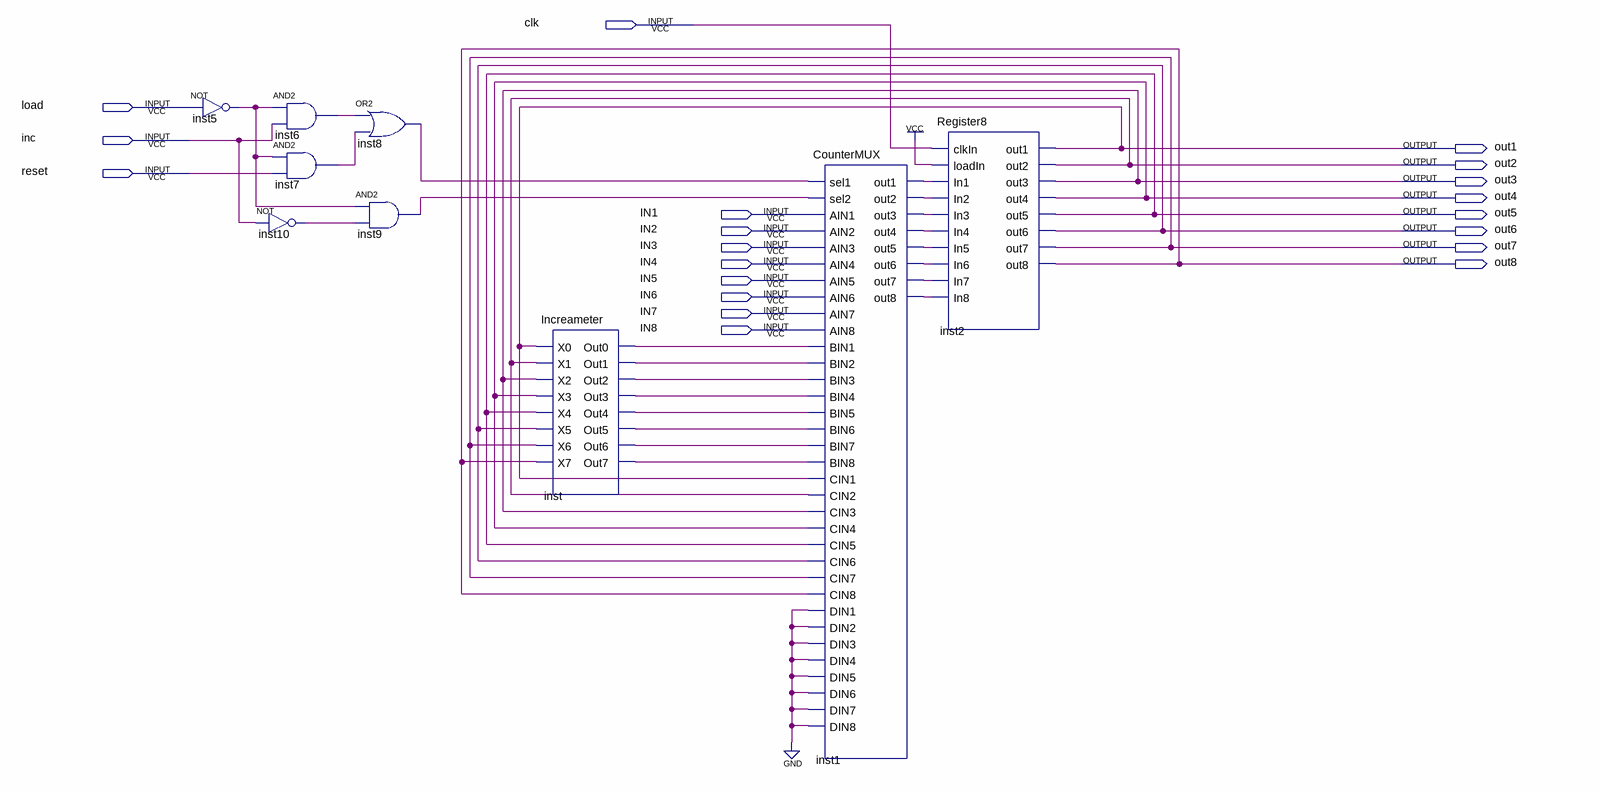
[diagram p0: schematic sheet]
// Quartus schematic ProgramCounter.bdf as structural Verilog: 9 symbols, 20 pins
module ProgramCounter (
  input  clk,
  input  load,
  input  inc,
  input  reset,
  input  IN1,
  input  IN2,
  input  IN3,
  input  IN4,
  input  IN5,
  input  IN6,
  input  IN7,
  input  IN8,
  output out1,
  output out2,
  output out3,
  output out4,
  output out5,
  output out6,
  output out7,
  output out8
);

  wire inst1_out1, inst1_out2, inst1_out3, inst1_out4, inst1_out5, inst1_out6, inst1_out7, inst1_out8,
       inst5_out, inst6_out, inst7_out, inst8_out, inst9_out, inst10_out, inst_out0, inst_out1, inst_out2,
       inst_out3, inst_out4, inst_out5, inst_out6, inst_out7;

  not inst5 (inst5_out, load);
  and inst6 (inst6_out, inst5_out, inc);
  and inst7 (inst7_out, inst5_out, reset);
  not inst10 (inst10_out, inc);
  or inst8 (inst8_out, inst6_out, inst7_out);
  and inst9 (inst9_out, inst5_out, inst10_out);
  Increameter inst (
    .X0(out1), .X1(out2), .X2(out3), .X3(out4), .X4(out5), .X5(out6), .X6(out7), .X7(out8), .Out0(inst_out0),
    .Out1(inst_out1), .Out2(inst_out2), .Out3(inst_out3), .Out4(inst_out4), .Out5(inst_out5),
    .Out6(inst_out6), .Out7(inst_out7));
  CounterMUX inst1 (
    .sel1(inst8_out), .sel2(inst9_out), .AIN1(IN1), .AIN2(IN2), .AIN3(IN3), .AIN4(IN4), .AIN5(IN5),
    .AIN6(IN6), .AIN7(IN7), .AIN8(IN8), .BIN1(inst_out0), .BIN2(inst_out1), .BIN3(inst_out2),
    .BIN4(inst_out3), .BIN5(inst_out4), .BIN6(inst_out5), .BIN7(inst_out6), .BIN8(inst_out7), .CIN1(out1),
    .CIN2(out2), .CIN3(out3), .CIN4(out4), .CIN5(out5), .CIN6(out6), .CIN7(out7), .CIN8(out8), .DIN1(1'b0),
    .DIN2(1'b0), .DIN3(1'b0), .DIN4(1'b0), .DIN5(1'b0), .DIN6(1'b0), .DIN7(1'b0), .DIN8(1'b0),
    .out1(inst1_out1), .out2(inst1_out2), .out3(inst1_out3), .out4(inst1_out4), .out5(inst1_out5),
    .out6(inst1_out6), .out7(inst1_out7), .out8(inst1_out8));
  Register8 inst2 (
    .clkIn(clk), .loadIn(1'b1), .In1(inst1_out1), .In2(inst1_out2), .In3(inst1_out3), .In4(inst1_out4),
    .In5(inst1_out5), .In6(inst1_out6), .In7(inst1_out7), .In8(inst1_out8), .out1(out1), .out2(out2),
    .out3(out3), .out4(out4), .out5(out5), .out6(out6), .out7(out7), .out8(out8));
endmodule
